# Altium schematic sheet 5-CAN_TRANSCEIVER.SchDoc: CAN TRANSCEIVER
size A4; Author: Alexandre Cosneau; CompanyName: Tristar Multicopters; DrawnBy: Alexandre Cosneau; Engineer: Alexandre Cosneau; Organization: Tristar Multicopters; Address1: Genie / GEGI; Address2: 2500 boulevard de l'universite; Address3: J1K2R SHERBROOKE; Address4: QUEBEC, CANADA; DocumentNumber: 12; Revision: 1.0; SheetNumber: 12; SheetTotal: 15
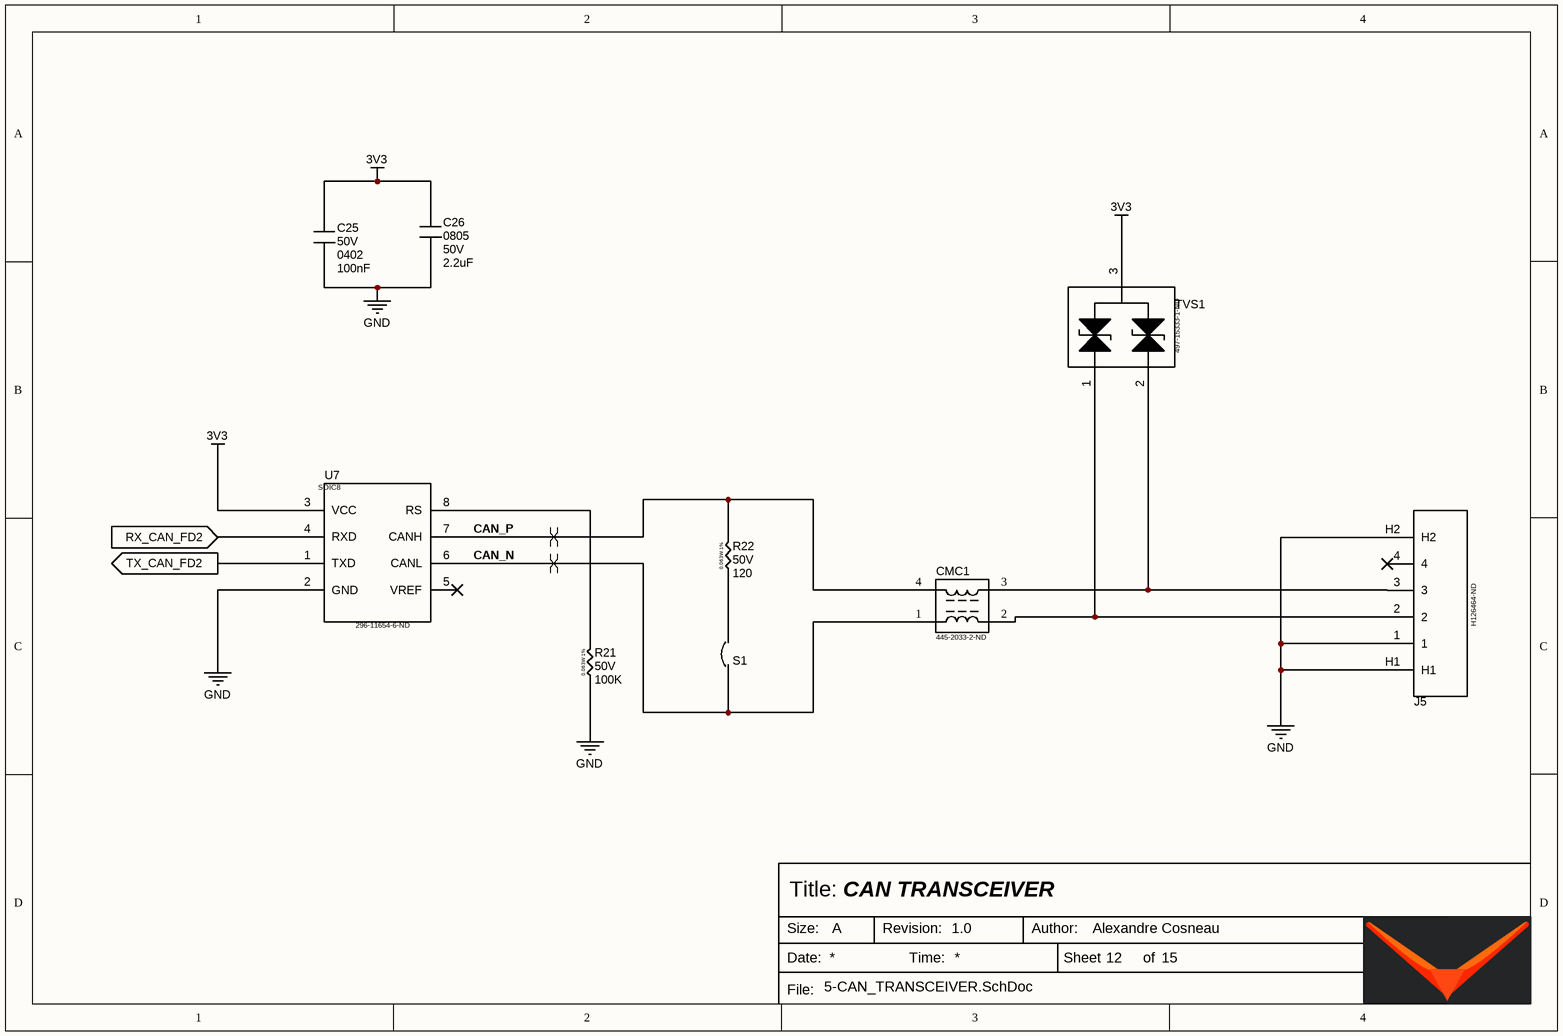
[diagram p0: 5-CAN_TRANSCEIVER.SchDoc]

## Parts
C25  VDC: 50V  Package: 0402  [C 0402(1005)x0.5]  (hidden comment: 100nF)
C26  Package: 0805  VDC: 50V  [C 0805(2012)x0.65]  (hidden comment: 2.2uF)
CMC1  Supplier Part Number 1: 445-2033-2-ND  [CMC_1210]  (hidden comment: TCM0403S)
J5  Supplier Part Number 1: H126464-ND  [DF13C-4P-1.25V]  (hidden comment: DF13C-4P-1.25V)
R21  VDC: 50V  [R 0402(1005)-1%]  (hidden comment: 100K)
R22  VDC: 50V  [R 0402(1005)-1%]  (hidden comment: 120)
S1  SHORT_PARALLEL  [SHORT_PARALLEL]  (value not drawn)  (net tie, no BOM)
TVS1  Supplier Part Number 1: 497-15333-1-ND  [SOT23_3_0.95_1.6]  (hidden comment: SOT23)
U7  SOIC8  Supplier Part Number 1: 296-11654-6-ND  [SOIC-8_1.27_4]

## Ports
RX_CAN_FD2 (in), TX_CAN_FD2 (out)

## Nets
3V3: C25.1 C26.1 TVS1.3 U7.3(VCC)
GND: C25.2 C26.2 J5.1 J5.H1 J5.H2 R21.1 U7.2(GND)
CAN_N: CMC1.1 S1.1 U7.6(CANL)
CAN_P: CMC1.4 R22.2 U7.7(CANH)
RX_CAN_FD2: U7.4(RXD) ; port RX_CAN_FD2
TX_CAN_FD2: U7.1(TXD) ; port TX_CAN_FD2
NetCMC1_2: CMC1.2 J5.2 TVS1.1
NetCMC1_3: CMC1.3 J5.3 TVS1.2
NetR21_2: R21.2 U7.8(RS)
NetR22_1: R22.1 S1.2

Not connected (* = marked no-connect by the designer): J5 4*; U7 5(VREF)*

## Layout directives
differential pair: CAN_N, CAN_P

## Notes on the sheet
- Title:
- Size:
- Date:
- A
- Revision:
- Time:
- Author:
- Sheet
- of
- File:
- (in symbol RES 0402-1%) 0.063W 1%

## Library data of the parts
C25 = CAP 0402 100nF 50V X7R: SMD-0402 100nF 50V X7R 10%; Part Number: CL05B104KB5NNNC; Manufacturer: Samsung; TYPE: Capacitors; Package-mm: 1005; Mount Type: SMT; Publisher: Hefest; Manufacturer Alternate: *; Part Number Alternate: *; Published: 07.04.2019; Supplier 1: Comet; Supplier 2: *; Supplier 3: *; Supplier Part Number 1: C0402 100nF 50V X7R; Supplier Part Number 2: *; Supplier Part Number 3: *; RoHS: Y; Technology: Ceramic  MLCC; Value 1: *; Value 2: *; TempCo: X7R; Tolerance %: ±10%; VAC: *; ESR Ohm: *; ComponentLink1Description: Datasheet link; ComponentLink1URL: https://store.comet.bg/download-file.php?id=11; Temperature Range: -55°C ~ +125°C; Price: 0.039; Value: 100nF
C26 = CAP 0805 2.2nF 50V X7R: SMD-0805 50V X7R 10%; Part Number: CL21B222KBNC; Manufacturer: Samsung; TYPE: Capacitors; Package-mm: 2012; Mount Type: SMT; Publisher: Hefest; Manufacturer Alternate: *; Part Number Alternate: *; Published: 07.04.2019; Supplier 1: Comet; Supplier 2: *; Supplier 3: *; Supplier Part Number 1: C0805 2.2nF 50V X7R SAMSUNG; Supplier Part Number 2: *; Supplier Part Number 3: *; RoHS: Y; Technology: Ceramic  MLCC; Value 1: *; Value 2: *; TempCo: X7R; Tolerance %: ±10%; VAC: *; ESR Ohm: *; ComponentLink1Description: Datasheet link; ComponentLink1URL: https://store.comet.bg/download-file.php?id=11; Temperature Range: -55°C ~ +125°C; Price: 0.026; Value: 2.2uF
CMC1 = TCM0403S: CMC 200mA 1K @100MHz 1210; [Author]: Alexandre Cosneau; Parameter 1: *; Supplier 1: Digi-Key
J5 = DF13C-4P-1.25V: HEADER MALE  4P 1.25 PITCH UP RIGHT; Supplier 1: Digi-Key
R21 R22 = RES 0402-1%: SMD 0402 0.063W 1% 50V; Manufacturer: YAGEO; TempCo: ±100ppm/°C; Package-mm: 1005; Value Code: 1001; Power: 0.0625W; Part Number: *; Mount Type: SMT; Publisher: Hefest; Manufacturer Alternate: *; Published: 07.04.2019; Supplier 1: Comet; Supplier 2: *; Supplier 3: *; Supplier Part Number 1: R0402 1.0K 1% YAG/ASJ; Supplier Part Number 2: *; Supplier Part Number 3: *; RoHS: Y; Technology: Thick film; Value 2: *; Package: 0402; Tolerance %: ±1%; ComponentLink1Description: Datasheet link; ComponentLink1URL: https://store.comet.bg/download-file.php?id=1224; Temperature Range: -55°C ~ +155°C; Price: 0.015; Part Number Alternate: *; TYPE: Resistor; Value 1: *
  R21: Value: 100K
  R22: Value: 120
S1 = SHORT_PARALLEL: SHORTABLE PARALLEL PCB LINK
TVS1 = ESDCAN01: TVS CAN PROTECT; Supplier 1: Digi-Key; PACKAGE: SOT23; TYPE: TVS
U7 = SN65HVD230: CAN TRANSCIEVER; Supplier 1: Digi-Key